# Altium schematic sheet sensor.SchDoc
size A4; DocumentNumber: 4; SheetNumber: 1; SheetTotal: 1
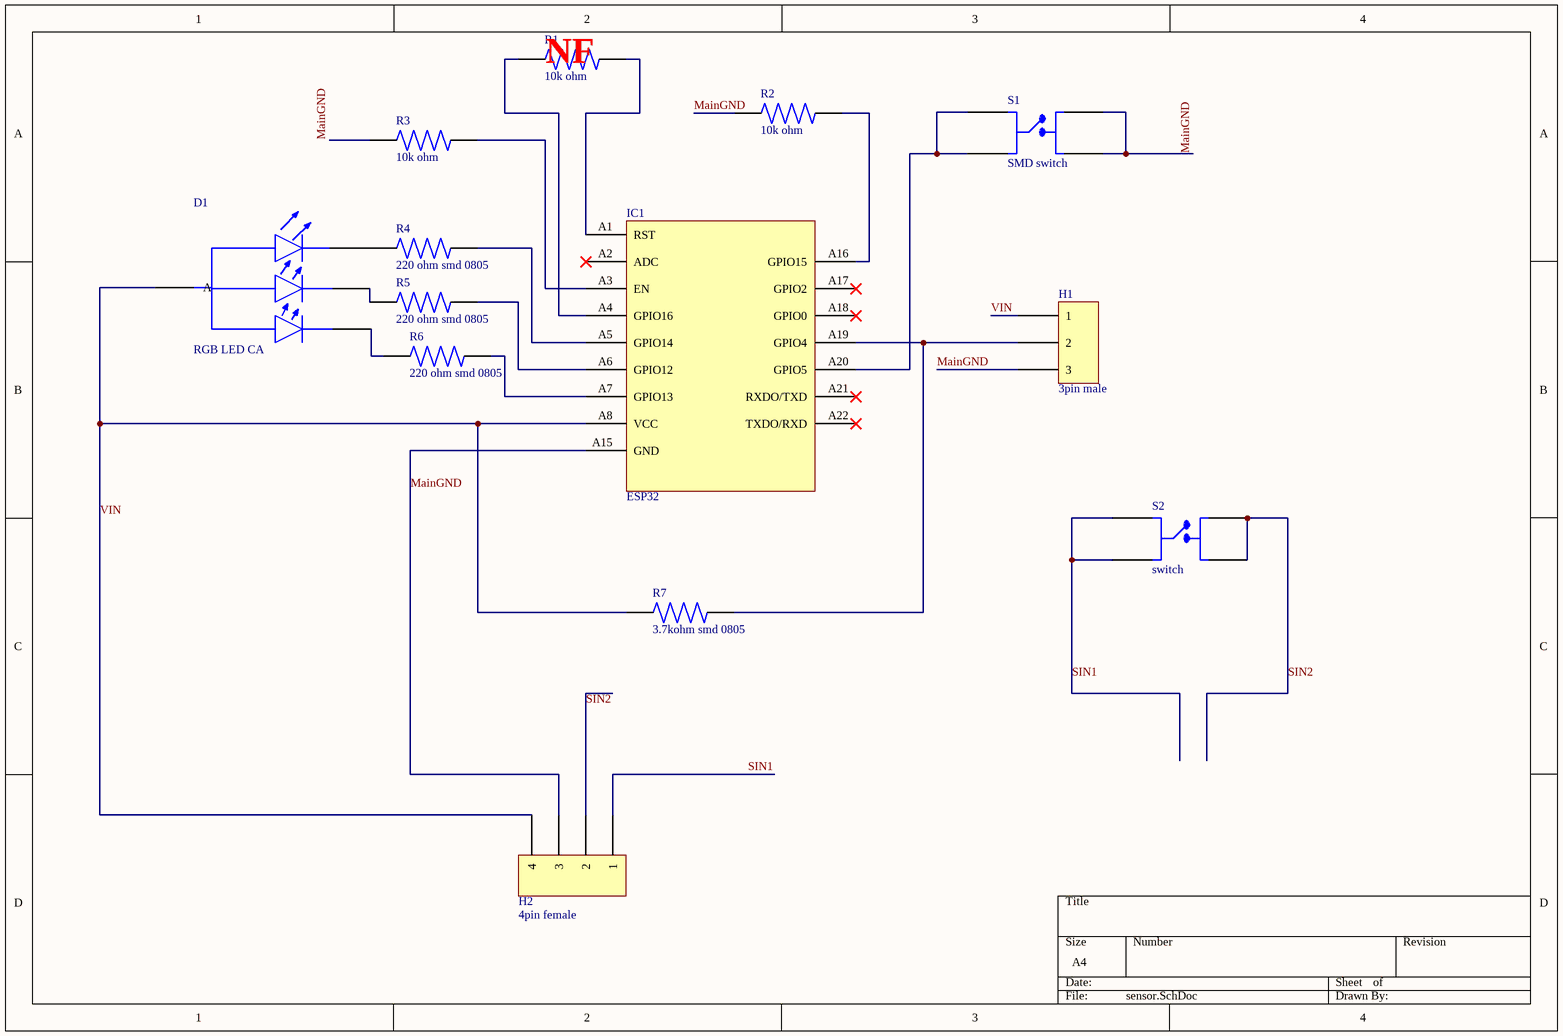
[diagram p0: sensor.SchDoc]

## Parts
D1  RGB LED CA  [RGB LED]
H1  3pin male  [3 pin Male header]
H2  4pin female  [4pin female]
IC1  ESP32  [ESP 32 12f]
R1  10k ohm  [0805 SMD]
R2  10k ohm  [0805 SMD]
R3  10k ohm  [0805 SMD]
R4  220 ohm smd 0805  [0805 SMD]
R5  220 ohm smd 0805  [0805 SMD]
R6  220 ohm smd 0805  [0805 SMD]
R7  3.7kohm smd 0805  [0805 SMD]
S1  SMD switch  [SOP127P600-8N]
S2  switch  [SW_TS02-66-60-BK-260-LCR-D]

## Nets
MainGND: H1.3 H2.3 IC1.A15(GND) R2.1 R3.1 S1.3 S1.4
SIN1: H2.1 S2.1 S2.2
SIN2: H2.2 S2.3 S2.4
VIN: D1.2(A) H1.1 H2.4 IC1.A8(VCC) R7.1
NetD1_1: D1.1 R4.1
NetD1_3: D1.3 R5.1
NetD1_4: D1.4 R6.1
NetH1_2: H1.2 IC1.A19(GPIO4) R7.2
NetIC1_A1: IC1.A1(RST) R1.2
NetIC1_A3: IC1.A3(EN) R3.2
NetIC1_A4: IC1.A4(GPIO16) R1.1
NetIC1_A5: IC1.A5(GPIO14) R4.2
NetIC1_A6: IC1.A6(GPIO12) R5.2
NetIC1_A7: IC1.A7(GPIO13) R6.2
NetIC1_A16: IC1.A16(GPIO15) R2.2
NetIC1_A20: IC1.A20(GPIO5) S1.1 S1.2

Not connected (* = marked no-connect by the designer): IC1 A2(ADC)* A17(GPIO2)* A18(GPIO0)* A21(RXDO/TXD)* A22(TXDO/RXD)*

## Notes on the sheet
- (near R1) NF

## Library data of the parts
D1 = QBL8RGB60D0-2897: Led Rgb, T-1 3/4, 5MM Round T/h,; Manufacturer: QT-Brightek; Supplier: Digikey; Supplier Part Number: 1516-QBL8RGB60D0-2897-ND; Manufacturer Part Number: QBL8RGB60D0-2897; RoHS: No; Category: LEDs; Stock: 24575; Pricing: 1=1.06, 10=0.743, 100=0.5504, 500=0.4646, 1000=0.43654, 2000=0.41271, 5000=0.3867, 10000=0.37049, 25000=0.35284 (USD)
H1 = M20-9990345: Board Connector, 3 Contact(s), 1 Row(s), Male, Straight, 0.1 inch Pitch, Solder Terminal, Locking, Black Insulator; Manufacturer: Harwin; Option: General Purpose; Additional Feature: ROHS COMPLIANT; Body/Shell Style: RECEPTACLE; Contact Pattern: RECTANGULAR; Contact Resistance: 25mR; Dielectric Withstanding Voltage (AC): 750V; Durability: 300Cycles; Filter Feature: No; Insulation Resistance: 1GR; Number Of Connectors: 1; Rated Current (Signal): 3A; Number of Contacts: 3; Body Length: 0.3inch; Reference Standard: UL; Reliability: COMMERCIAL; Supplier: Digikey; Supplier Part Number: 952-2263-ND; Manufacturer Part Number: M20-9990345; RoHS: Yes; Category: Headers and Wire Housings; Stock: 54918; Pricing: 1=0.15, 10=0.124, 100=0.1053, 500=0.09398, 1000=0.08949, 5000=0.07987, 10000=0.07606 (USD); Mounting Technology: Board; Contact Material: Brass; Contact Finish - Mating: GOLD; Contact Finish - Termination: Gold (Au) - with Nickel (Ni) barrier; Insulation Color: Black; Insulation Material: Nylon; Min Operating Temperature: -40°C; Max Operating Temperature: 105°C; JESD-609 Code: e4; Connector Type: BOARD CONNECTOR; Contact Gender: Male; Mixed Contacts: No; Mounting Style: STRAIGHT; Number Of PCB Rows: 1; Number of Rows Loaded: 1; Termination: Solder; Body Breadth: 0.1inch; Body Depth: 0.1inch; Mating Contact Pitch: 0.1inch; Mounting Option 1: LOCKING; Terminal Length: 0.118inch; Terminal Pitch: 2.54mm; Flammability Rating: UL94 V-0; Reach SVHC Compliant: Yes; RoHS Compliant: Yes; DIN Conformance: No; IEC Conformance: No; MIL Conformance: No; ComponentLink1URL: https://datasheet.ciiva.com:443/pdfs/VipMasterIC/IC/HRWN/HRWN-S-A0003033920/HRWN-S-A0003397280-1.pdf?src-supplier=IHS+Markit; ComponentLink1Description: https://datasheet.ciiva.com:443/pdfs/VipMasterIC/IC/HRWN/HRWN-S-A0003033920/HRWN-S-A0003397280-1.pdf?src-supplier=IHS+Markit; ComponentLink2URL: https://datasheet.ciiva.com/11747/0900766b80da602d-11747505.pdf?src-supplier=Rs; ComponentLink2Description: https://datasheet.ciiva.com/11747/0900766b80da602d-11747505.pdf?src-supplier=Rs; ComponentLink3URL: https://datasheet.ciiva.com/5160/m20-999-351179-5160492.pdf?src-supplier=Mouser; ComponentLink3Description: https://datasheet.ciiva.com/5160/m20-999-351179-5160492.pdf?src-supplier=Mouser; ComponentLink4URL: https://datasheet.ciiva.com/10151/m20-999-10151334.pdf?src-supplier=Avnet; ComponentLink4Description: https://datasheet.ciiva.com/10151/m20-999-10151334.pdf?src-supplier=Avnet
H2 = PPPC041LFBN-RC: Board Connector, 4 Contact(s), 1 Row(s), Female, Straight, 0.1 inch Pitch, Solder Terminal, Locking; Manufacturer: Sullins; Manufacturer Series: PP; Contact Pattern: RECTANGULAR; Contact Style: SQ PIN-SKT; Number Of Connectors: 1; Polarization Key: POLARIZED HOUSING; Rated Current (Signal): 3A; Number of Contacts: 4; Body Breadth: 0.094inch; Body Depth: 0.334inch; Body Length: 0.42inch; Reference Standard: UL; Reliability: COMMERCIAL; Supplier: Digikey; Supplier Part Number: S7037-ND; Manufacturer Part Number: PPPC041LFBN-RC; RoHS: Yes; Category: Connectors; Stock: 12576; Pricing: 1=0.42, 10=0.353, 100=0.2996, 500=0.26738, 1000=0.2546, 5000=0.22726, 10000=0.21641 (USD); Mounting Technology: Board; Contact Material: Bronze; Contact Finish - Mating: AU; Insulation Material: Polyester; Connector Type: BOARD CONNECTOR; Contact Gender: Female; Mounting Style: STRAIGHT; Number Of PCB Rows: 1; Number of Rows Loaded: 1; PCB Contact Pattern: RECTANGULAR; Termination: Solder; Mating Contact Pitch: 0.1inch; Mounting Option 1: LOCKING; Terminal Length: 0.125inch; Terminal Pitch: 2.54mm; Reach SVHC Compliant: Yes; RoHS Compliant: Yes; ComponentLink1URL: https://datasheet.ciiva.com:443/pdfs/VipMasterIC/IC/SUCS/SUCSS00270/SUCSS00270-1.pdf?src-supplier=IHS+Markit; ComponentLink1Description: https://datasheet.ciiva.com:443/pdfs/VipMasterIC/IC/SUCS/SUCSS00270/SUCSS00270-1.pdf?src-supplier=IHS+Markit; ComponentLink2URL: https://media.digikey.com/pdf/Data%20Sheets/Sullins%20PDFs/Female_Headers.100_DS.pdf?src-supplier=Digikey; ComponentLink2Description: https://media.digikey.com/pdf/Data%20Sheets/Sullins%20PDFs/Female_Headers.100_DS.pdf?src-supplier=Digikey; ComponentLink3URL: http://www.sullinscorp.com/catalogs/78_Page80-81_HEADER_.100_2.54mm_FEMALE.pdf?src-supplier=Future+Electronics; ComponentLink3Description: http://www.sullinscorp.com/catalogs/78_Page80-81_HEADER_.100_2.54mm_FEMALE.pdf?src-supplier=Future+Electronics; ComponentLink4URL: https://datasheet.octopart.com/PPPC041LFBN-RC-Sullins-datasheet-41308905.pdf?src-supplier=Future+Electronics; ComponentLink4Description: https://datasheet.octopart.com/PPPC041LFBN-RC-Sullins-datasheet-41308905.pdf?src-supplier=Future+Electronics
IC1 = ESP32-C3-12F: Wi-fi, BLE5.0, 32 Bit Mcu Int Ant; Manufacturer: RF Solutions; Supplier: Digikey; Supplier Part Number: 357-ESP32-C3-12F-ND; Manufacturer Part Number: ESP32-C3-12F; RoHS: No; Category: LDO; Stock: 13; Pricing: 1=7.67, 10=6.651 (USD)
R1-R3 = RMCF0805FT10K0: Fixed Resistor, Metal Glaze/thick Film, 0.125W, 10000ohm, 150V, 1% +/-Tol, 100ppm/Cel, Surface Mount, 0805; Manufacturer: Stackpole Electronics; Power: 125mW; Rated Temperature: 70°C; Value: 10kR; Temperature Coefficient (ppm/Cel): 100; Package Height: 0.5mm; Package Length: 2mm; Package Width: 1.25mm; Reference Standard: AEC-Q200; Supplier: Digikey; Supplier Part Number: RMCF0805FT10K0CT-ND; Manufacturer Part Number: RMCF0805FT10K0; RoHS: Yes; Category: Chip SMD Resistors; Stock: 1368386; Pricing: 1=0.1, 10=0.025, 100=0.012, 1000=0.00658, 2500=0.00538 (USD); Mounting Technology: Surface Mount; Pins: 2; Package Shape: Rectangular; Case/Package: 0805; Terminal Finish: Nickel; Min Operating Temperature: -55°C; Max Operating Temperature: 155°C; Tolerance: 1%; JESD-609 Code: e3; Resistor Type: FIXED RESISTOR; Construction: Rectangular; Packaging: Tape and Reel; Technology: METAL GLAZE/THICK FILM; Termination: Wraparound; Working Voltage: 150V; Reach SVHC Compliant: Yes; RoHS Compliant: Yes; ComponentLink1URL: https://datasheet.ciiva.com:443/pdfs/VipMasterIC/IC/SEIE/SEIE-S-A0009541969/SEIE-S-A0009541969-1.pdf?src-supplier=IHS+Markit; ComponentLink1Description: https://datasheet.ciiva.com:443/pdfs/VipMasterIC/IC/SEIE/SEIE-S-A0009541969/SEIE-S-A0009541969-1.pdf?src-supplier=IHS+Markit; ComponentLink2URL: https://datasheet.ciiva.com/15193/getdatasheetpartid-362046-15193525.pdf?src-supplier=Verical; ComponentLink2Description: https://datasheet.ciiva.com/15193/getdatasheetpartid-362046-15193525.pdf?src-supplier=Verical
R4-R6 = CRGCQ0805F220R: Fixed Resistor, Metal Glaze/thick Film, 0.125W, 220ohm, 150V, 1% +/-Tol, 100ppm/Cel, Surface Mount, 0805; Manufacturer: TE Connectivity; Supplier: Digikey; Supplier Part Number: A129741CT-ND; Manufacturer Part Number: CRGCQ0805F220R; RoHS: Yes; Category: Chip SMD Resistors; Stock: 1119462; Pricing: 1=0.1, 10=0.036, 100=0.0183, 1000=0.00952, 2500=0.00885 (USD); Pins: 2; Resistor Type: FIXED RESISTOR; Reach SVHC Compliant: Yes; RoHS Compliant: Yes; ComponentLink1URL: https://datasheet.ciiva.com:443/pdfs/VipMasterIC/IC/TYEL/TYEL-S-A0004929575/TYEL-S-A0004929575-1.pdf?src-supplier=IHS+Markit; ComponentLink1Description: https://datasheet.ciiva.com:443/pdfs/VipMasterIC/IC/TYEL/TYEL-S-A0004929575/TYEL-S-A0004929575-1.pdf?src-supplier=IHS+Markit; ComponentLink2URL: https://www.te.com/commerce/DocumentDelivery/DDEController?Action=srchrtrv&amp;DocNm=1773204-3&amp;DocType=DS&amp;DocLang=English&src-supplier=Digikey; ComponentLink2Description: https://www.te.com/commerce/DocumentDelivery/DDEController?Action=srchrtrv&amp;DocNm=1773204-3&amp;DocType=DS&amp;DocLang=English&src-supplier=Digikey; ComponentLink3URL: https://4donline.ihs.com/images/VipMasterIC/IC/TYEL/TYEL-S-A0004929575/TYEL-S-A0004929575-1.pdf?hkey=52A5661711E402568146F3353EA87419&src-supplier=Farnell; ComponentLink3Description: https://4donline.ihs.com/images/VipMasterIC/IC/TYEL/TYEL-S-A0004929575/TYEL-S-A0004929575-1.pdf?hkey=52A5661711E402568146F3353EA87419&src-supplier=Farnell; ComponentLink4URL: https://4donline.ihs.com/images/VipMasterIC/IC/TYEL/TYEL-S-A0004929575/TYEL-S-A0004929575-1.pdf?hkey=52A5661711E402568146F3353EA87419&src-supplier=Newark; ComponentLink4Description: https://4donline.ihs.com/images/VipMasterIC/IC/TYEL/TYEL-S-A0004929575/TYEL-S-A0004929575-1.pdf?hkey=52A5661711E402568146F3353EA87419&src-supplier=Newark; ComponentLink5URL: https://datasheet.octopart.com/CRGCQ0805F220R-TE-Connectivity-datasheet-114679081.pdf?src-supplier=Master+Electronics; ComponentLink5Description: https://datasheet.octopart.com/CRGCQ0805F220R-TE-Connectivity-datasheet-114679081.pdf?src-supplier=Master+Electronics
R7 = RN73R2ATTD3701D25: Fixed Resistor, Thin Film, 0.125W, 3700ohm, 150V, 0.5% +/-Tol, 25ppm/Cel, Surface Mount, 0805; Manufacturer: KOA Speer; Supplier: Digikey; Supplier Part Number: 2019-RN73R2ATTD3701D25CT-ND; Manufacturer Part Number: RN73R2ATTD3701D25; RoHS: Yes; Category: Chip SMD Resistors; Stock: 862; Pricing: 1=0.1, 10=0.078, 50=0.0688, 100=0.065, 500=0.0571 (USD)
S1 = PTS526SK15SMTR2LFS: Switch Tactile N.O. SPST Round Button Gull Wing 0.05A 12VDC 200000Cycles 2.45N SMD T/R; Manufacturer: ITT C&K; Supplier: Digikey; Supplier Part Number: CKN12221-1-ND; Manufacturer Part Number: PTS526SK15SMTR2LFS; RoHS: No; Stock: 96228; Pricing: 1=0.14, 10=0.127, 25=0.1192, 100=0.1073, 250=0.09968, 500=0.09408, 1000=0.08878 (USD); ComponentLink1URL: https://dznh3ojzb2azq.cloudfront.net/products/Tactile/PTS526/documents/datasheet.pdf?src-supplier=Digikey; ComponentLink1Description: https://dznh3ojzb2azq.cloudfront.net/products/Tactile/PTS526/documents/datasheet.pdf?src-supplier=Digikey; ComponentLink2URL: https://datasheet.octopart.com/PTS526SK15SMTR2LFS-C%26K-Components-datasheet-138817219.pdf?src-supplier=Future+Electronics; ComponentLink2Description: https://datasheet.octopart.com/PTS526SK15SMTR2LFS-C%26K-Components-datasheet-138817219.pdf?src-supplier=Future+Electronics; ComponentLink3URL: https://datasheet.octopart.com/PTS526SK15SMTR2LFS-C%26K-Components-datasheet-166147767.pdf?src-supplier=TME; ComponentLink3Description: https://datasheet.octopart.com/PTS526SK15SMTR2LFS-C%26K-Components-datasheet-166147767.pdf?src-supplier=TME
S2 = 1825910-6: Keypad Switch, 1 Switches, SPST, Momentary-tactile, 0.05A, 24VDC, 2.06N, 4 PCB Hole Cnt, Solder Terminal, Through Hole-straight; Manufacturer: TE Connectivity Alcoswitch; Circuit Configuration: 1X1; Contact Current(DC)-Max: 50mA; Contact DC Max Rating R Load: .05A@24VDC; Contact Voltage(DC)-Max: 24V; Number of Switches: 1; Body Breadth: 5.99mm; Body Height: 3.61mm; Supplier: Digikey; Supplier Part Number: 450-1650-ND; Manufacturer Part Number: 1825910-6; RoHS: Yes; Category: Pushbutton Switches; Stock: 41424; Pricing: 1=0.13, 10=0.118, 25=0.1112, 100=0.1001, 250=0.093, 750=0.08485, 1500=0.08009, 3000=0.07565, 5250=0.07234 (USD); Mounting Technology: Through Hole; Min Operating Temperature: -35°C; Max Operating Temperature: 85°C; Termination: Solder; Operating Force-Max: 2.06N; Switch Action: MOMENTARY; Switch Function: SPST; Switch Type: Keypad; Body Length or Diameter: 5.99mm; Reach SVHC Compliant: Yes; RoHS Compliant: Yes; ComponentLink1URL: https://datasheet.ciiva.com:443/pdfs/VipMasterIC/IC/TYEL/TYEL-S-A0008869674/TYEL-S-A0008850909-1.pdf?src-supplier=IHS+Markit; ComponentLink1Description: https://datasheet.ciiva.com:443/pdfs/VipMasterIC/IC/TYEL/TYEL-S-A0008869674/TYEL-S-A0008850909-1.pdf?src-supplier=IHS+Markit; ComponentLink2URL: https://datasheet.ciiva.com/30199/1825910-6rqpn1825910-6-30199520.pdf?src-supplier=Onlinecomponents.com; ComponentLink2Description: https://datasheet.ciiva.com/30199/1825910-6rqpn1825910-6-30199520.pdf?src-supplier=Onlinecomponents.com; ComponentLink3URL: https://datasheet.ciiva.com/15184/getdatasheetpartid-395915-15184509.pdf?src-supplier=Verical; ComponentLink3Description: https://datasheet.ciiva.com/15184/getdatasheetpartid-395915-15184509.pdf?src-supplier=Verical